# EasyEDA Pro project delta机械臂.eprj

# Schematic Schematic1

## Sheets
1 P1: Board Name: Board1; Create Date: 2025-07-07; Page Name: P1; Project Name: delta机械臂; Schematic Name: Schematic1; Update Date: 2025-09-25; Company: 嘉立创EDA; Page Size: A4; Version: V1.0
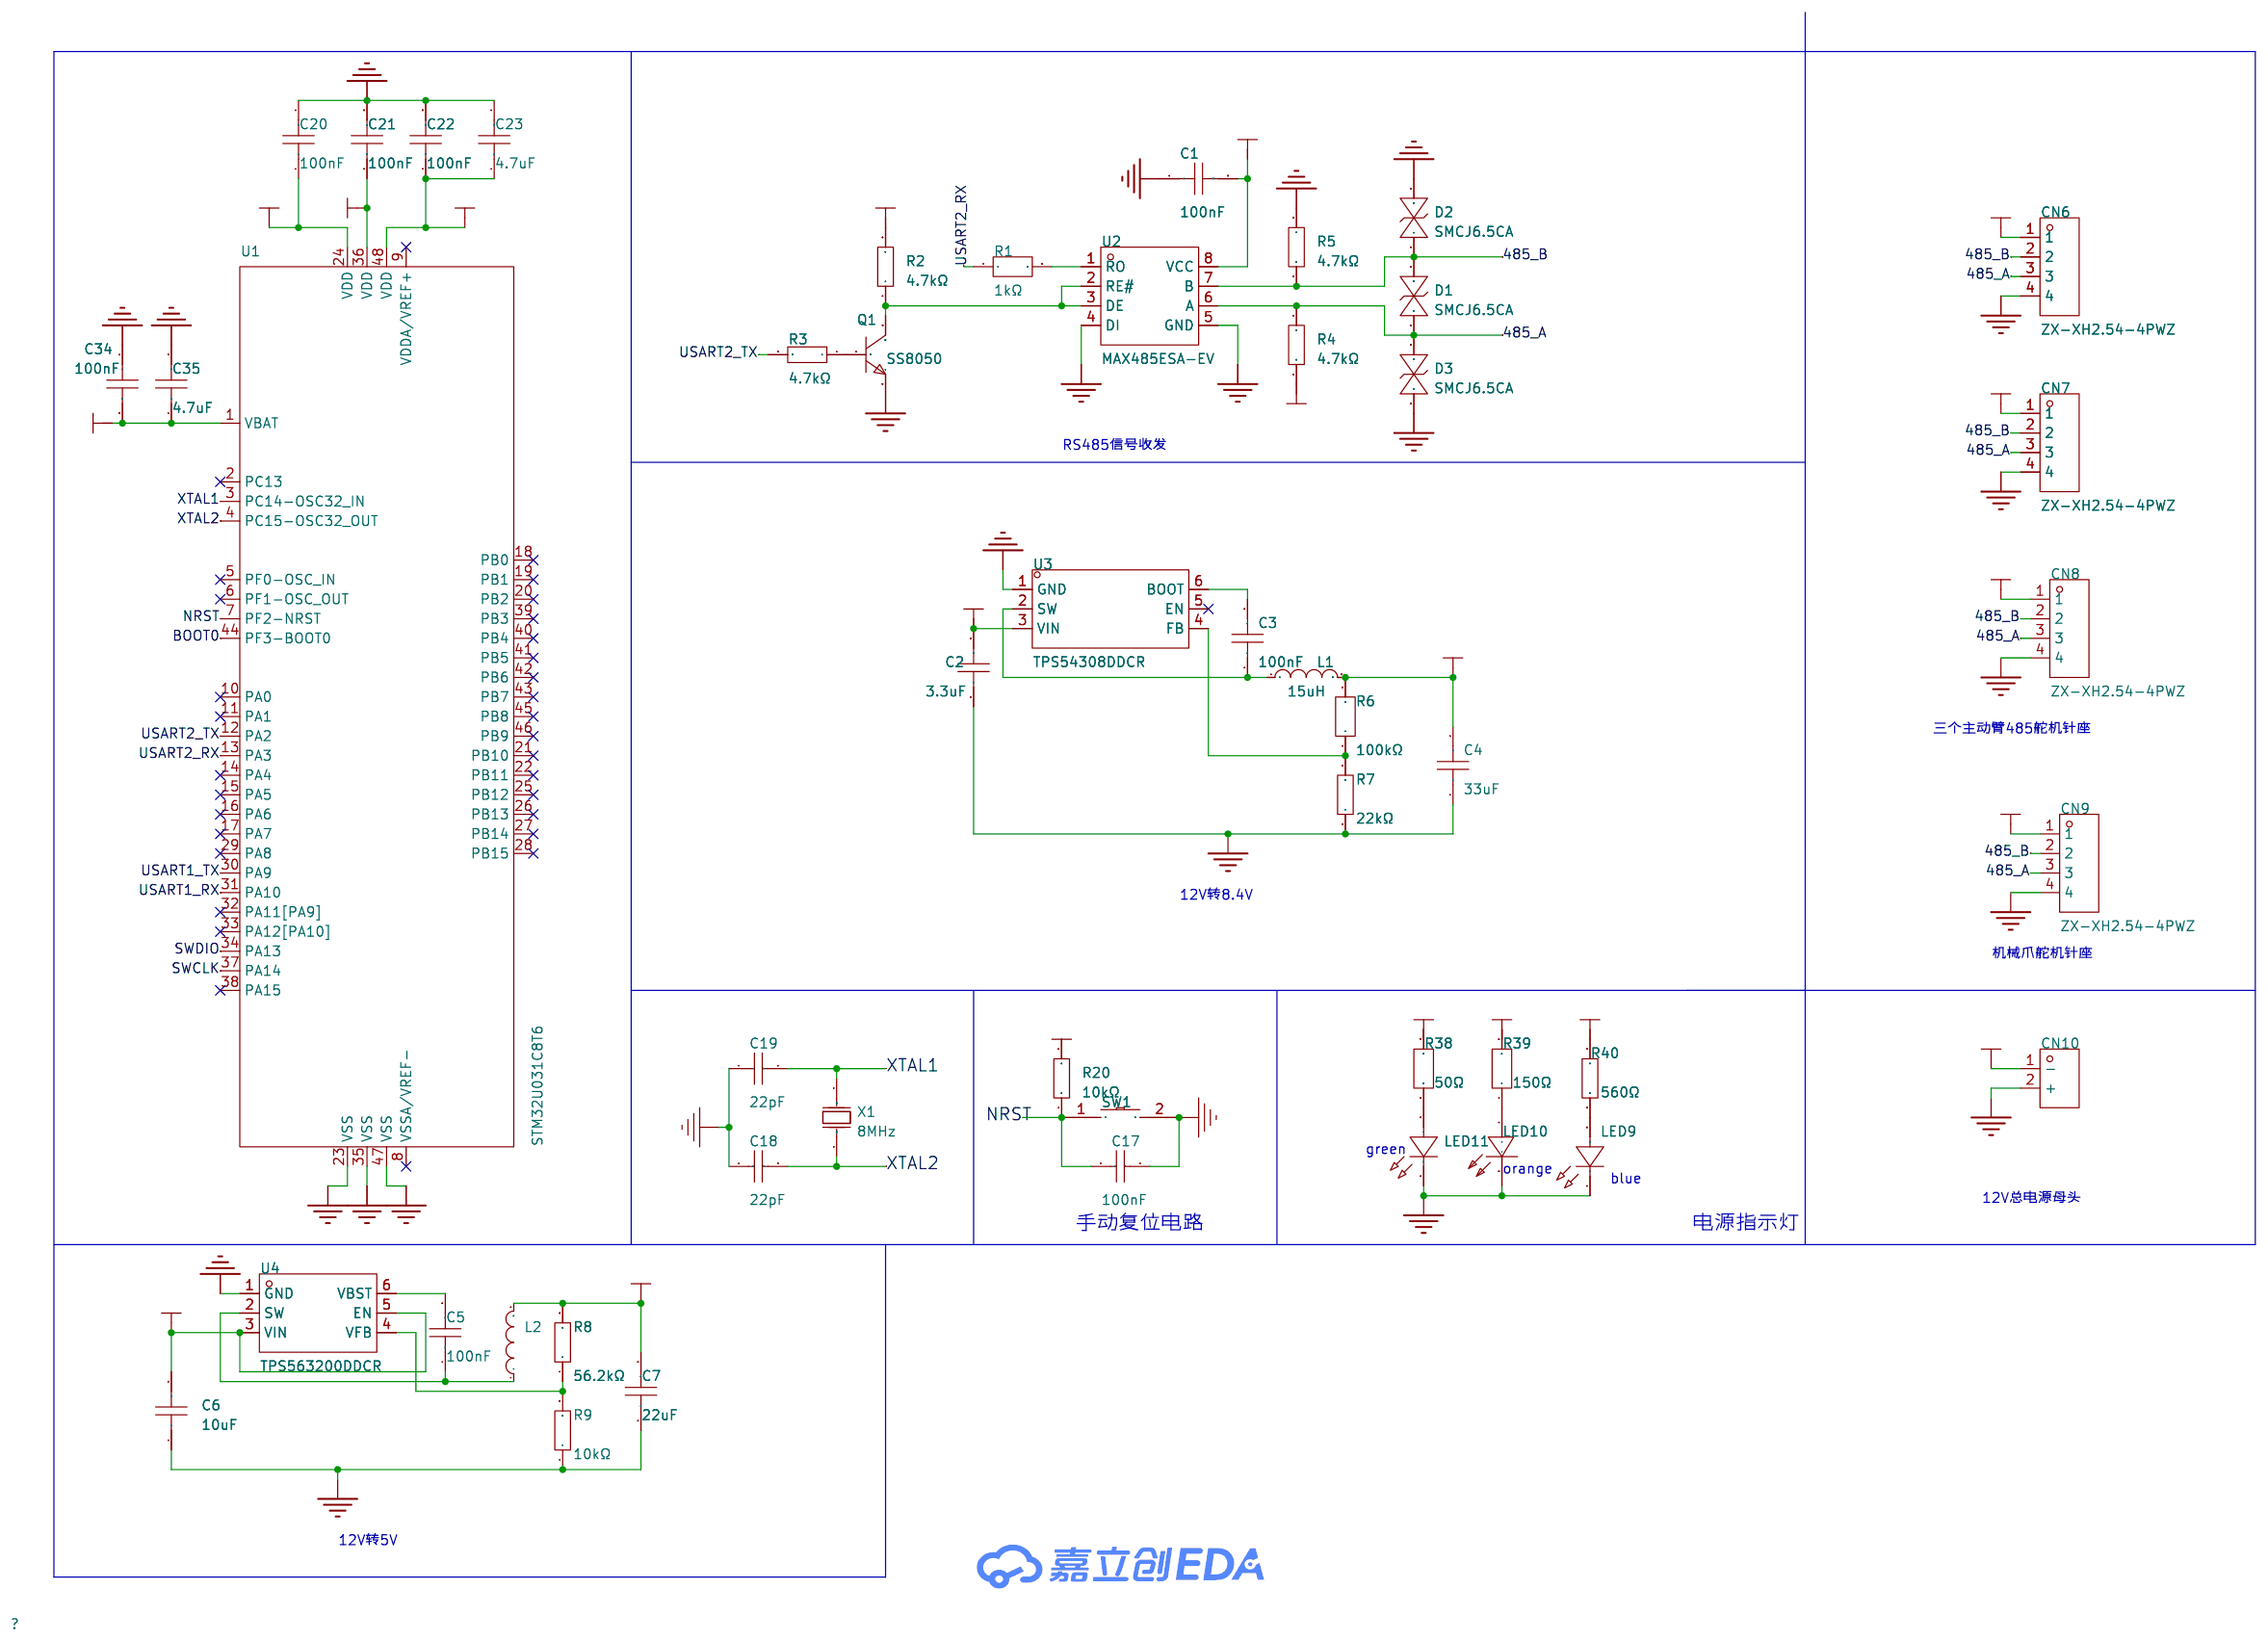
[diagram p0: P1]
2 P2: Create Date: 2025-07-26; Page Name: P2; Update Date: 2025-08-18
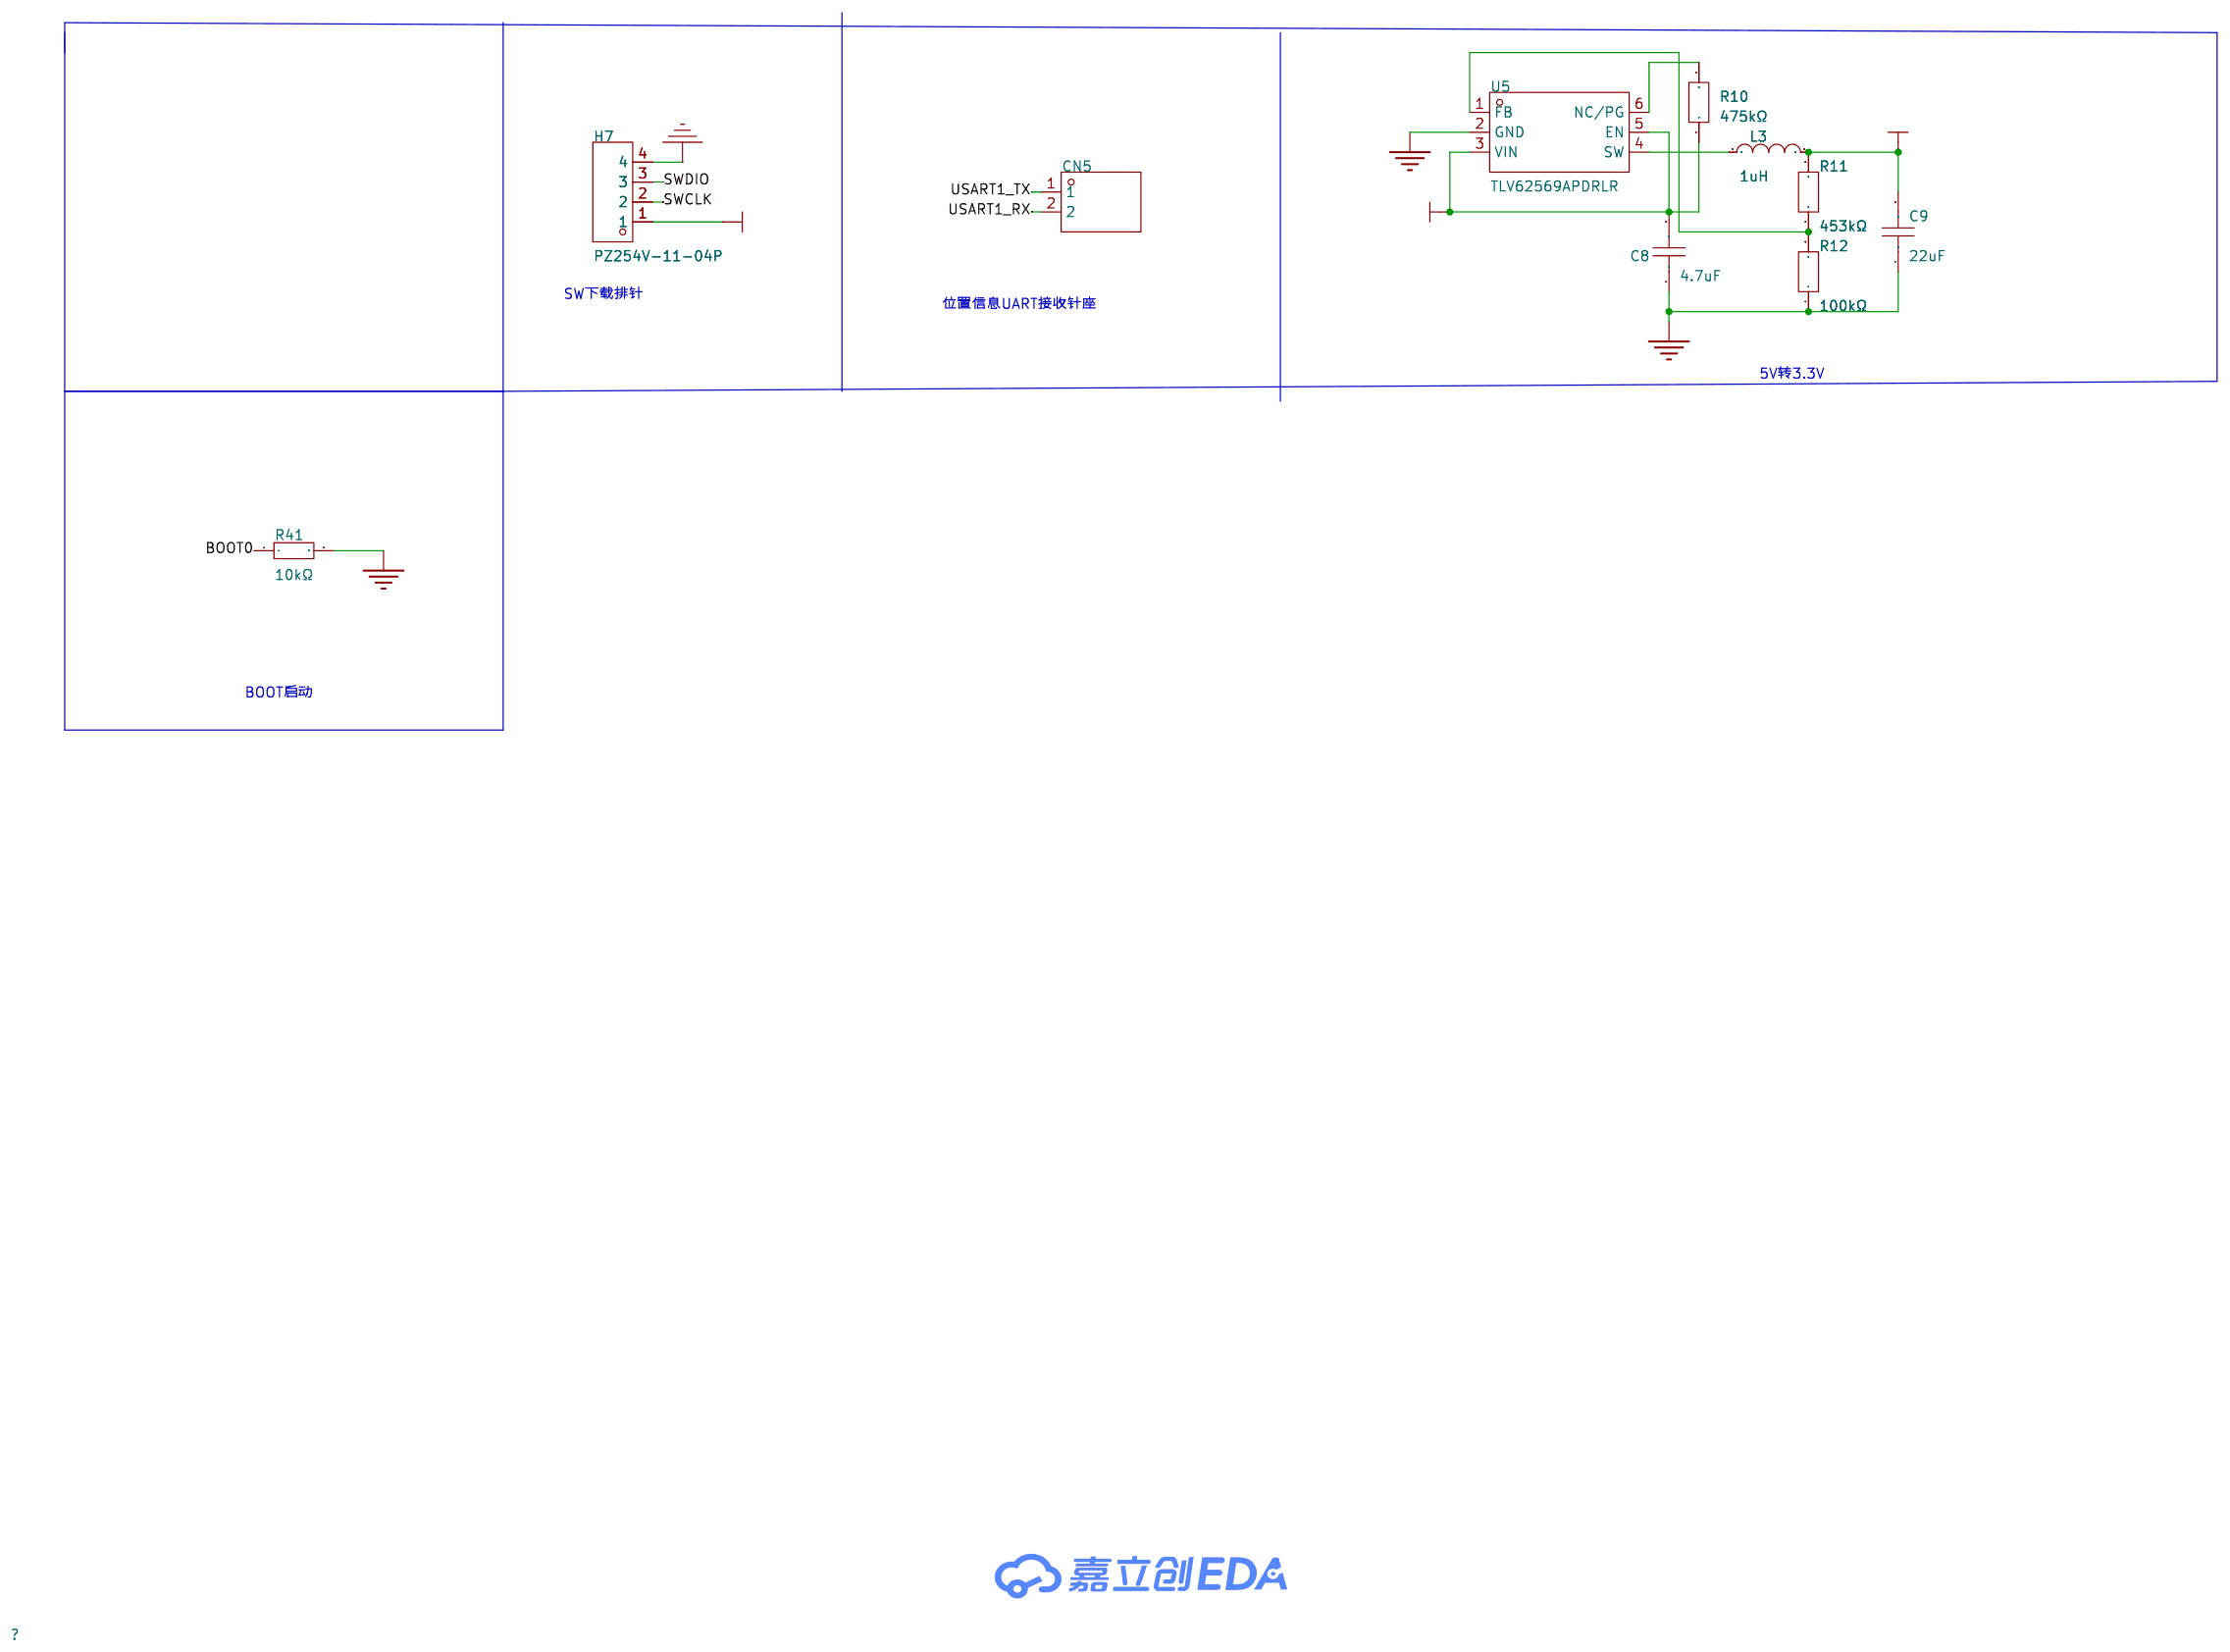
[diagram p1: P2]

## Parts
sheet P1
C1  100nF  [C0603]
C2  3.3uF  [C0603]
C3  100nF  [C0805]
C4  33uF  [C0805]
C5  100nF  [C0805]
C6  10uF  [C0805]
C7  22uF  [C0805]
C17  100nF  [C0805]
C18  22pF  [C0805]
C19  22pF  [C0805]
C20  100nF  [C0805]
C21  100nF  [C0805]
C22  100nF  [C0805]
C23  4.7uF  [C0805]
C34  100nF  [C0805]
C35  4.7uF  [C0805]
CN6  ZX-XH2.54-4PWZ  [CONN-TH_4P-P2.50_ZX-XH2.54-4PWZ]
CN7  ZX-XH2.54-4PWZ  [CONN-TH_4P-P2.50_ZX-XH2.54-4PWZ]
CN8  ZX-XH2.54-4PWZ  [CONN-TH_4P-P2.50_ZX-XH2.54-4PWZ]
CN9  ZX-XH2.54-4PWZ  [CONN-TH_4P-P2.50_ZX-XH2.54-4PWZ]
CN10  XT30UPB-M  [CONN-TH_XT30UPB-M]
D1  SMCJ6.5CA  [SMC_L6.8-W5.9-LS7.9-BI]
D2  SMCJ6.5CA  [SMC_L6.8-W5.9-LS7.9-BI]
D3  SMCJ6.5CA  [SMC_L6.8-W5.9-LS7.9-BI]
L1  15uH  [IND-SMD_L10.2-W10.0]
L2  VLP8040T-3R3N  [IND-SMD_L8.7-W8.6]
LED9  XL-1608UBC-04  [LED0603-RD_BLUE]
LED10  SZYY0603O  [LED0603-R-RD_ORANGE]
LED11  TZ-P2-0603YGTCS1-0.6T  [LED0603-RD]
Q1  SS8050  [SOT-23-3_L2.9-W1.3-P1.90-LS2.4-BR]
R1  1kΩ  [R0603]
R2  4.7kΩ  [R0603]
R3  4.7kΩ  [R0603]
R4  4.7kΩ  [R0603]
R5  4.7kΩ  [R0603]
R6  100kΩ  [R0402]
R7  22kΩ  [R0603]
R8  56.2kΩ  [R0201]
R9  10kΩ  [R0201]
R20  10kΩ  [R0805]
R38  50Ω  [R0805]
R39  150Ω  [R0805]
R40  560Ω  [R0805]
SW1  TS-1101-C-W  [SW-SMD_L6.0-W3.3-LS8.0]
U1  STM32U031C8T6  [LQFP-48_L7.0-W7.0-P0.50-LS9.0-BL_1]
U2  MAX485ESA-EV  [SOIC-8_L4.9-W3.9-P1.27-LS6.0-BL]
U3  TPS54308DDCR  [SOT-23-6_L2.9-W1.6-P0.95-LS2.8-BR]
U4  TPS563200DDCR  [SOT-23-6_L2.9-W1.6-P0.95-LS2.8-BR]
X1  8MHz  [CRYSTAL-SMD_L11.5-W4.8-LS12.7]
sheet P2
C8  4.7uF  [C0603]
C9  22uF  [C0603]
CN5  B2B-XH-A(LF)(SN)  [CONN-TH_B2B-XH-A-LF-SN]
H7  PZ254V-11-04P  [HDR-TH_4P-P2.54-V-M]
L3  1uH  [IND-SMD_L8.2-W7.9]
R10  475kΩ  [R0402]
R11  453kΩ  [R0402]
R12  100kΩ  [R0402]
R41  10kΩ  [R0805]
U5  TLV62569APDRLR  [SOT-563_L1.6-W1.2-P0.50-LS1.6-BR]

## Library data of the parts
C1 = CGA0603X7R104K500JT: LCSC Part Name: 100nF ±10% 50V; Supplier Part: C6119867; Manufacturer: HRE(芯声); Supplier Footprint: 0603; JLCPCB Part Class: 扩展库; Datasheet: https://atta.szlcsc.com/upload/public/pdf/source/20250103/C44077DA9E7B3EFAE02F22B6D3D1CBC9.pdf; Supplier: LCSC; Tolerance: ±10%; Voltage Rating: 50V; Temperature Coefficient: X7R
C2 = C1608X5R1V335K080AC: LCSC Part Name: 3.3uF ±10% 35V; Supplier Part: C6476469; Manufacturer: TDK; Supplier Footprint: 0603; Datasheet: https://atta.szlcsc.com/upload/public/pdf/source/20230606/A83975C7E70EF5AFCD4A17254ABD78F2.pdf; Supplier: LCSC; Tolerance: ±10%; Voltage Rating: 35V; Temperature Coefficient: X5R
C3 = C0805C104M5RACTU: LCSC Part Name: 100nF ±20% 50V; Supplier Part: C2167099; Manufacturer: KEMET(基美); Supplier Footprint: 0805; JLCPCB Part Class: 扩展库; Datasheet: https://atta.szlcsc.com/upload/public/pdf/source/20210401/FA43491E9CEFD02B2522131A2AAB865C.pdf; Supplier: LCSC; Tolerance: ±20%; Voltage Rated: 50V; Temperature Coefficient: X7R
C4 = C2012X5R1A336M125AC: LCSC Part Name: 33uF ±20% 10V; Supplier Part: C2168036; Manufacturer: TDK; Supplier Footprint: 0805; Datasheet: https://item.szlcsc.com/datasheet/C2012X5R1A336M125AC/2260088.html; Supplier: LCSC; Tolerance: ±20%; Voltage Rating: 10V; Temperature Coefficient: X5R
C5 = 08053C104KAT2A: LCSC Part Name: 100nF ±10% 25V; Supplier Part: C167411; Manufacturer: Kyocera AVX; Supplier Footprint: 0805; JLCPCB Part Class: 扩展库; Datasheet: https://atta.szlcsc.com/upload/public/pdf/source/20180224/C180862_15194369279611363953.pdf; Supplier: LCSC; Tolerance: ±10%; Voltage Rated: 25V; Temperature Coefficient: X7R
C6 = CL21A106KAYNNNE_C15850: LCSC Part Name: 10uF ±10% 25V; Supplier Part: C15850; Manufacturer: SAMSUNG(三星); Manufacturer Part: CL21A106KAYNNNE; Supplier Footprint: 0805; JLCPCB Part Class: 基础库; Datasheet: https://atta.szlcsc.com/upload/public/pdf/source/20160218/1457707763339.pdf; Supplier: LCSC; Tolerance: ±10%; Voltage Rated: 25V; Temperature Coefficient: X5R
C7 = GRM21BR61A226ME44L: LCSC Part Name: 22uF ±20% 10V; Supplier Part: C441864; Manufacturer: muRata(村田); Supplier Footprint: 0805; JLCPCB Part Class: 扩展库; Datasheet: https://atta.szlcsc.com/upload/public/pdf/source/20200305/C490387_23319AE8C154DEB24C505E6C82A8106A.pdf; Supplier: LCSC; Tolerance: ±20%; Voltage Rated: 10V; Temperature Coefficient: X5R
C17 = CL21B104KCFNNNE: LCSC Part Name: 100nF ±10% 100V; Supplier Part: C28233; Manufacturer: SAMSUNG(三星); Supplier Footprint: 0805; JLCPCB Part Class: 基础库; Datasheet: https://atta.szlcsc.com/upload/public/pdf/source/20160218/1457707763339.pdf; Supplier: LCSC; Tolerance: ±10%; Voltage Rated: 100V; Temperature Coefficient: X7R
C18 C19 = CL21C220JBANNNC: LCSC Part Name: 22pF ±5% 50V; Supplier Part: C1804; Manufacturer: SAMSUNG(三星); Supplier Footprint: 0805; JLCPCB Part Class: 基础库; Datasheet: https://atta.szlcsc.com/upload/public/pdf/source/20160218/1457707763339.pdf; Supplier: LCSC; Tolerance: ±5%; Voltage Rated: 50V; Temperature Coefficient: C0G
C20-C22 C34 = CC0805KRX7R9BB104: LCSC Part Name: 100nF ±10% 50V; Supplier Part: C49678; Manufacturer: YAGEO(国巨); Supplier Footprint: 0805; JLCPCB Part Class: 基础库; Datasheet: https://atta.szlcsc.com/upload/public/pdf/source/20180224/C181747_15194369449651363981.pdf; Supplier: LCSC; Tolerance: ±10%; Voltage Rated: 50V; Temperature Coefficient: X7R
C23 C35 = CGA0805X7R475K350MT: LCSC Part Name: 4.7uF ±10% 35V; Supplier Part: C6119943; Manufacturer: HRE(芯声); Supplier Footprint: 0805; JLCPCB Part Class: 扩展库; Supplier: LCSC; Tolerance: ±10%; Voltage Rated: 35V; Temperature Coefficient: X7R
CN6-CN9 = ZX-XH2.54-4PWZ: LCSC Part Name: 1x4P 间距:2.5mm 弯插 系列:XH; Supplier Part: C7429643; Manufacturer: Megastar(兆星); Supplier Footprint: 弯插,P=2.5mm; JLCPCB Part Class: 扩展库; Datasheet: https://item.szlcsc.com/datasheet/ZX-XH2.54-4PWZ/8427560.html; Supplier: LCSC; Pins Structure: 1x4P; Pitch: 2.5mm; Mounting Type: 弯插; Reference Series: XH; Number of Pins: 4P; Number of Rows: 1; Number of PINs Per Row: 4; Current Rating: 3A; Contact Material: 黄铜; Contact Plating: 锡; Operating Temperature: -25℃~+85℃; Voltage Rating: 250V; Plastic Material: PA66; Flame Retardant Rating: UL94V-0; Color: 白色; Z-Height of the Board: 5.9mm; X-Length of Bottom Edge on Board (Spacing Line): 12.5mm; Y-Width of Bottom Edge on Board: 7.32mm
CN10 = XT30UPB-M: LCSC Part Name: AMASS(艾迈斯)板载立式 航模锂电池控制器连接器插头 公头XT30UPB-M; Supplier Part: C428721; Manufacturer: AMASS(艾迈斯); JLCPCB Part Class: 扩展库; Datasheet: https://item.szlcsc.com/datasheet/XT30UPB-M/423831.html; Supplier: LCSC; Type: 航模插头; Colour: 黄色; RatedVoltage: DC 500V; InterfaceType: 公头; MetalMaterial: 镀金; InsulationMaterial: PA; RatedCurrent: 15A; contact resistance: 0.65mΩ
D1-D3 = SMCJ6.5CA_C20623833: Supplier Part: C20623833; Manufacturer: Brightking(君耀电子); Supplier Footprint: SMC; JLCPCB Part Class: 扩展库; Datasheet: https://atta.szlcsc.com/upload/public/pdf/source/20240223/9A65FA5599D1B01CD9C6D8029383C398.pdf; Supplier: LCSC
L1 = MSS1038-153MLC: Supplier Part: C18212714; Manufacturer: Coilcraft(线艺); Supplier Footprint: SMD,10.2x10mm; JLCPCB Part Class: 扩展库; Datasheet: https://www.coilcraft.com/getmedia/3e03a7b4-3b1d-4f31-b1f3-e7c621695ac0/mss1038.pdf; Supplier: LCSC; Tolerance: ±20%
L2 = VLP8040T-3R3N: LCSC Part Name: ±30%; Supplier Part: C20464369; Manufacturer: TDK; Datasheet: https://atta.szlcsc.com/upload/public/pdf/source/20181022/C307849_B481C7A0812203402FA1143FFCB19149.pdf; Supplier: LCSC; Tolerance: ±30%
LED9 = XL-1608UBC-04: LCSC Part Name: 0603蓝色贴片式发光二极管; Supplier Part: C965807; Manufacturer: XINGLIGHT(成兴光); Supplier Footprint: 0603; JLCPCB Part Class: 扩展库; Datasheet: https://item.szlcsc.com/datasheet/XL-1608UBC-04/1051416.html; Supplier: LCSC; Illumination Color: 蓝色; Voltage - Forward(Vf): 3.3V; Power(Watts): 70mW; Forward Current: 20mA; Wavelength - Dominant: 455nm~475nm; Peak Wavelength: 470nm; Lens Color: 无色透明透镜; Luminous Intensity: 300mcd; Viewing Angle: 120°; Mounting Style: 正贴
LED10 = SZYY0603O: LCSC Part Name: 橙灯; Supplier Part: C434425; Manufacturer: yongyu(永裕光电); Supplier Footprint: 0603; JLCPCB Part Class: 扩展库; Datasheet: https://atta.szlcsc.com/upload/public/pdf/source/20191204/C434425_679BD20504459C5C77B058A13BF09BD8.pdf; Supplier: LCSC; Emitted Color: 橙色; Power Dissipation: 40mW; Forward Current: 10mA; Dominant Wavelength: 598nm~608nm; Peak Wavelength: 612nm; Lens Color: 无色透明透镜; Viewing Angle: 120°; Operating Temperature: -40℃~+85℃
LED11 = TZ-P2-0603YGTCS1-0.6T: LCSC Part Name: 普绿/黄绿; Supplier Part: C916074; Manufacturer: TUOZHAN(拓展光电); Supplier Footprint: 0603; JLCPCB Part Class: 扩展库; Datasheet: https://item.szlcsc.com/datasheet/TZ-P2-0603YGTCS1-0.6T/990102.html; Supplier: LCSC; Illumination Color: 绿色; Voltage - Forward(Vf): 1.9V~2.4V; Power(Watts): 60mW; Forward Current: 20mA; Wavelength - Dominant: 570nm~575nm; Peak Wavelength: 574nm; Lens Color: 无色透明透镜; Luminous Intensity: 50mcd; Viewing Angle: 120°; Operating Temperature: -40℃~+80℃
Q1 = SS8050: LCSC Part Name: NPN 25V 1.5A 120-400 SOT-23; Supplier Part: C2931717; Manufacturer: Doeshare(德芯); Supplier Footprint: SOT-23; JLCPCB Part Class: 扩展库; Datasheet: https://atta.szlcsc.com/upload/public/pdf/source/20220106/99F9A3DFCBDD91265C711555CE6390BF.pdf; Supplier: LCSC
R1 = FCR0603F1K: LCSC Part Name: 1K ±1%; Supplier Part: C5913168; Manufacturer: VO(翔胜); Supplier Footprint: 0603; JLCPCB Part Class: 扩展库; Datasheet: https://atta.szlcsc.com/upload/public/pdf/source/20230428/98B65D379E9BA4CF2A9223D1647B01B6.pdf; Supplier: LCSC; Type: 厚膜电阻; Tolerance: ±1%; Power(Watts): 100mW; Overload Voltage (Max): 75V; Operating Temperature Range: -55℃~+155℃
R2-R5 = 0603WAF4701T5E: LCSC Part Name: 4.7kΩ ±1% 100mW 厚膜电阻; Supplier Part: C23162; Manufacturer: UNI-ROYAL(厚声); Supplier Footprint: 0603; JLCPCB Part Class: 基础库; Datasheet: https://atta.szlcsc.com/upload/public/pdf/source/20200306/C422600_1E6D84923E4A46A82E41ADD87F860B5C.pdf; Supplier: LCSC; Type: 厚膜电阻; Tolerance: ±1%; Power(Watts): 100mW; Overload Voltage (Max): 75V; Temperature Coefficient: ±100ppm/℃; Operating Temperature Range: -55℃~+155℃
R6 R12 = CRCW0402100KFKED: LCSC Part Name: 厚膜电阻 100kΩ ±1% 63mW; Supplier Part: C481918; Manufacturer: VISHAY(威世); Supplier Footprint: 0402; Datasheet: https://item.szlcsc.com/datasheet/CRCW0402100KFKED/489944.html; Supplier: LCSC; Type: 厚膜电阻; Tolerance: ±1%; Power(Watts): 63mW; Voltage-Supply(Max): 75V; Temperature Coefficient: ±100ppm/℃; Operating Temperature: -55℃~+155℃
R7 = RC0603FR-0722KL: LCSC Part Name: 厚膜电阻 22kΩ ±1% 100mW; Supplier Part: C114065; Manufacturer: YAGEO(国巨); Supplier Footprint: 0603; JLCPCB Part Class: 扩展库; Datasheet: https://item.szlcsc.com/datasheet/RC0603FR-0722KL/115304.html; Supplier: LCSC; Type: 厚膜电阻; Tolerance: ±1%; Power(Watts): 100mW; Voltage-Supply(Max): 75V; Temperature Coefficient: ±100ppm/℃; Operating Temperature: -55℃~+155℃
R8 = RC0201FR-0756K2L: LCSC Part Name: 厚膜电阻 56.2kΩ ±1% 50mW; Supplier Part: C327383; Manufacturer: YAGEO(国巨); Supplier Footprint: 0201; Datasheet: https://atta.szlcsc.com/upload/public/pdf/source/20250610/89E4D743C004A82A45145C7A2CC3A578.pdf; Supplier: LCSC; Type: 厚膜电阻; Tolerance: ±1%; Power(Watts): 50mW; Voltage-Supply(Max): 25V; Temperature Coefficient: ±200ppm/℃; Operating Temperature: -55℃~+125℃
R9 = RC0201FR-0710KL: LCSC Part Name: 厚膜电阻 10kΩ ±1% 50mW; Supplier Part: C106225; Manufacturer: YAGEO(国巨); Supplier Footprint: 0201; JLCPCB Part Class: 扩展库; Datasheet: https://item.szlcsc.com/datasheet/RC0201FR-0710KL/107440.html; Supplier: LCSC; Type: 厚膜电阻; Tolerance: ±1%; Power(Watts): 50mW; Voltage-Supply(Max): 25V; Temperature Coefficient: ±200ppm/℃; Operating Temperature: -55℃~+125℃
R20 R41 = 0805W8F1002T5E_C17414: LCSC Part Name: 10kΩ ±1% 125mW 厚膜电阻; Supplier Part: C17414; Manufacturer: UNI-ROYAL(厚声); Manufacturer Part: 0805W8F1002T5E; Supplier Footprint: 0805; JLCPCB Part Class: 基础库; Datasheet: https://atta.szlcsc.com/upload/public/pdf/source/20200306/C422600_1E6D84923E4A46A82E41ADD87F860B5C.pdf; Supplier: LCSC; Type: 厚膜电阻; Tolerance: ±1%; Power(Watts): 125mW; Overload Voltage (Max): 150V; Temperature Coefficient: ±100ppm/℃; Operating Temperature Range: -55℃~+155℃
R38 = ARG05FTC0500: LCSC Part Name: 薄膜电阻 50Ω ±1% 125mW; Supplier Part: C2828866; Manufacturer: Viking(光颉); Supplier Footprint: 0805; JLCPCB Part Class: 扩展库; Datasheet: https://atta.szlcsc.com/upload/public/pdf/source/20211009/C2828883_CAE7D170B8B230FC4A048BDC7B3A81FC.pdf; Supplier: LCSC; Type: 薄膜电阻; Tolerance: ±1%; Power(Watts): 125mW; Overload Voltage (Max): 150V; Temperature Coefficient: ±25ppm/℃; Operating Temperature Range: -55℃~+155℃
R39 = FRC0805J151 TS: LCSC Part Name: 150Ω ±5% 125mW 厚膜电阻; Supplier Part: C2907300; Manufacturer: FOJAN(富捷); Supplier Footprint: 0805; JLCPCB Part Class: 扩展库; Datasheet: https://atta.szlcsc.com/upload/public/pdf/source/20211221/925EC7D7225764EE0046F22065062C87.pdf; Supplier: LCSC; Type: 厚膜电阻; Tolerance: ±5%; Power(Watts): 125mW; Overload Voltage (Max): 150V; Temperature Coefficient: ±100ppm/℃; Operating Temperature Range: -55℃~+155℃
R40 = 0805W8F5600T5E: LCSC Part Name: 560Ω ±1% 125mW 厚膜电阻; Supplier Part: C28636; Manufacturer: UNI-ROYAL(厚声); Supplier Footprint: 0805; JLCPCB Part Class: 基础库; Datasheet: https://atta.szlcsc.com/upload/public/pdf/source/20200306/C422600_1E6D84923E4A46A82E41ADD87F860B5C.pdf; Supplier: LCSC; Type: 厚膜电阻; Tolerance: ±1%; Power(Watts): 125mW; Overload Voltage (Max): 150V; Temperature Coefficient: ±100ppm/℃; Operating Temperature Range: -55℃~+155℃
SW1 = TS-1101-C-W: LCSC Part Name: 6*3.6*2.5mm 立贴 轻触开关; Supplier Part: C318938; Manufacturer: XKB Connectivity(中国星坤); Supplier Footprint: SMD; JLCPCB Part Class: 扩展库; Datasheet: https://atta.szlcsc.com/upload/public/pdf/source/20200227/C318938_C2E53B1EEDE37D980A33616AC086DE53.pdf; Supplier: LCSC; Circuit: 单刀单掷; Actuator Style: 矩形按钮; Operating Force: 260gf; Mounting Style: 立贴; Switch Length: 6mm; Switch Width: 3.6mm; Switch Height: 2.5mm; Strike Gundam: 不带; Contact Current: 50mA; Voltage Rating (DC): 12V; Actuator/Cap Color: 白色带淡绿; With Lamp: 无; Mechanical Life: 5万次; Operating Temperature: -30℃~+85℃
U1 = STM32U031C8T6: Supplier Part: C9900155493; Supplier Footprint: LQFP48; Supplier: LCSC
U2 = MAX485ESA-EV: Supplier Part: C28642204; Manufacturer: EVVO(翊欧); Supplier Footprint: SOP-8; JLCPCB Part Class: 扩展库; Datasheet: https://atta.szlcsc.com/upload/public/pdf/source/20240712/60855B1C00EFEBB875C1185125556C25.pdf; Supplier: LCSC
U3 = TPS54308DDCR: LCSC Part Name: 4.5V至28V输入,3A输出同步降压转换器; Supplier Part: C168839; Manufacturer: TI(德州仪器); Supplier Footprint: SOT-23-6; Datasheet: https://www.ti.com/cn/lit/gpn/tps54308; Supplier: LCSC; Function: 降压型; Output Type: 固定; Input Voltage: 4.5V~28V; Output Voltage: 3.3V; Output Current: 3A; Switching Frequency: 350kHz; Operating Temperature: -40℃~+125℃; Synchronous Rectification: 是; Number of Outputs: 1; Topology: 降压式; Quiescent Current (Iq): 300uA; Switch tube (built-in/external): 内置
U4 = TPS563200DDCR: LCSC Part Name: 4.5V至17V输入,2A/3A同步降压稳压器; Supplier Part: C97253; Manufacturer: TI(德州仪器); Supplier Footprint: TSOT-23-6; JLCPCB Part Class: 扩展库; Datasheet: https://www.ti.com/cn/lit/gpn/tps563200; Supplier: LCSC; Function: 降压型; Output Type: 可调; Input Voltage: 4.5V~17V; Output Voltage: 760mV~7V; Output Current: 3A; Switching Frequency: 650kHz; Operating Temperature: -40℃~+125℃; Synchronous Rectification: 是; Number of Outputs: 1; Topology: 降压式; Quiescent Current (Iq): 290uA; Switch tube (built-in/external): 内置
X1 = X49SM8MSD2SC: LCSC Part Name: HC-49SMD 8MHZ 2P 49SMD 20PF ±20PPM -20~70℃（±30PPM）; Supplier Part: C12674; Manufacturer: YXC(扬兴晶振); Supplier Footprint: HC-49S-SMD; JLCPCB Part Class: 基础库; Datasheet: https://atta.szlcsc.com/upload/public/pdf/source/20240329/3EBF42EBCAB50CA65B6FA9D7CFA1955A.pdf; Supplier: LCSC; Type: 贴片晶振; Normal temperature Frequency Tolerance: ±20ppm; Load Capacitance: 20pF; Frequency Stability: ±30ppm; Operating Temperature: -20℃~+70℃
C8 = CL10A475KO8NNNC: LCSC Part Name: 4.7uF ±10% 16V; Supplier Part: C19666; Manufacturer: SAMSUNG(三星); Supplier Footprint: 0603; Datasheet: https://item.szlcsc.com/datasheet/CL10A475KO8NNNC/20375.html; Supplier: LCSC; Tolerance: ±10%; Voltage Rating: 16V; Temperature Coefficient: X5R
C9 = GRM188R60J226MEA0D: LCSC Part Name: 22uF ±20% 6.3V; Supplier Part: C77042; Manufacturer: muRata(村田); Supplier Footprint: 0603; JLCPCB Part Class: 扩展库; Datasheet: https://atta.szlcsc.com/upload/public/pdf/source/20200305/C490387_23319AE8C154DEB24C505E6C82A8106A.pdf; Supplier: LCSC; Tolerance: ±20%; Voltage Rated: 6.3V; Temperature Coefficient: X5R
CN5 = B2B-XH-A(LF)(SN): LCSC Part Name: 1x2P 间距:2.5mm 直插 系列:XH; Supplier Part: C158012; Manufacturer: JST; Supplier Footprint: 插件,P=2.5mm; JLCPCB Part Class: 扩展库; Datasheet: https://atta.szlcsc.com/upload/public/pdf/source/20180928/C265283_F9DFEEBDB2CF642B6BDFAB4B77BD2680.pdf; Supplier: LCSC; Pins Structure: 1x2P; Pitch: 2.5mm; Mounting Style: 直插; Reference Series: XH; Number of Pins: 2P; Number of Rows: 1; Number of PINs Per Row: 2; Current Rating (Max): 3A; Contact Material: 黄铜; Contact Plating: 锡; Operating Temperature Range: -25℃~+85℃; Rated Voltage (Max): 250V; Plastic Material: PA66; Flame Retardant Rating: UL94V-0; Supplementary Features: 打K脚; Colour: 白色; Z-Height of the Board: 7mm; X-Length of Bottom Edge on Board (Spacing Line): 7.4mm; Y-Width of Bottom Edge on Board: 5.75mm
H7 = PZ254V-11-04P: LCSC Part Name: 间距:2.54mm 1x4P 直插 方针; Supplier Part: C2691448; Manufacturer: XFCN(兴飞); Supplier Footprint: 插件,P=2.54mm; JLCPCB Part Class: 扩展库; Datasheet: https://atta.szlcsc.com/upload/public/pdf/source/20200309/C492403_F9F19131791D08044AD4F84F8E751A34.pdf; Supplier: LCSC; Pin Structure: 1x4P; Pitch: 2.54mm; Circluar Pins/Square Pins: 方针; Mounting Type: 直插; Number of Rows: 单排; Number of Pins: 4P; Current Rating (Max): 3A; Voltage Rating (Max): 250V; Length of Mating Pin: 6mm; Insulation Height: 2.5mm; Length of End Connection Pin: 3mm; Operating Temperature Range: -40℃~+105℃; Color: 黑色
L3 = SRN8040-1R0Y: LCSC Part Name: 1uH ±30% 11A; Supplier Part: C2041438; Manufacturer: BOURNS; Supplier Footprint: SMD,8.2x7.9mm; JLCPCB Part Class: 扩展库; Datasheet: https://item.szlcsc.com/datasheet/SRN8040-1R0Y/2133001.html; Supplier: LCSC; Tolerance: ±30%; Current Rating: 7.8A; Current - Saturation(Isat): 11A; DC Resistance(DCR): 10mΩ
R10 = CRCW0402475KFKED: LCSC Part Name: 厚膜电阻 475kΩ ±1% 62.5mW; Supplier Part: C2085628; Manufacturer: VISHAY(威世); Supplier Footprint: 0402; JLCPCB Part Class: 扩展库; Datasheet: https://atta.szlcsc.com/upload/public/pdf/source/20210503/4CAD3FA9B4C9A749933C1C52DBF827C2.pdf; Supplier: LCSC; Type: 厚膜电阻; Tolerance: ±1%; Power(Watts): 62.5mW; Overload Voltage (Max): 75V; Temperature Coefficient: ±100ppm/℃; Operating Temperature Range: -55℃~+155℃
R11 = CRCW0402453KFKED: LCSC Part Name: 厚膜电阻 453kΩ ±1% 62.5mW; Supplier Part: C843903; Manufacturer: VISHAY(威世); Supplier Footprint: 0402; JLCPCB Part Class: 扩展库; Datasheet: https://item.szlcsc.com/datasheet/CRCW0402453KFKED/903477.html; Supplier: LCSC; Type: 厚膜电阻; Tolerance: ±1%; Power(Watts): 62.5mW; Voltage-Supply(Max): 50V; Temperature Coefficient: ±100ppm/℃; Operating Temperature: -55℃~+155℃
U5 = TLV62569APDRLR: Supplier Part: C398366; Manufacturer: TI(德州仪器); Supplier Footprint: SOT-563; JLCPCB Part Class: 扩展库; Datasheet: https://www.ti.com/cn/lit/gpn/tlv62568a; Supplier: LCSC; Function: 降压型; Output Type: 可调; Voltage - Supply: 2.5V~5.5V; Output Voltage: 600mV~5.5V; Output Current: 2A; Frequency - Switching: 1.5MHz; Operating Temperature: -40℃~+125℃@(TJ); Synchronous Rectifier: 是; Number of Outputs: 1; Topology: 降压式; Switch tube (built-in/external): 内置

## Nets
3.3V: C1.2 C9.2 C20.1 C21.1 C22.1 C23.1 C34.2 C35.1 H7.1 L3.2 R2.2 R4.2 R11.2 R20.2 R38.2 U1.1(VBAT) U1.24(VDD) U1.36(VDD) U1.48(VDD) U2.8(VCC)
5V: C7.2 C8.2 L2.2 R8.2 R10.1 R39.2 U5.3(VIN) U5.5(EN)
8.4V: C4.2 CN6.1 CN7.1 CN8.1 CN9.1 L1.2 R6.2
12V: C2.2 C6.2 CN10.1(-) R40.2 U3.3(VIN) U4.3(VIN) U4.5(EN)
GND: C1.1 C2.1 C4.1 C6.1 C7.1 C8.1 C9.1 C17.2 C18.1 C19.1 C20.2 C21.2 C22.2 C23.2 C34.1 C35.2 CN6.4 CN7.4 CN8.4 CN9.4 CN10.2(+) D2.2 D3.1 H7.4 LED9.1(K) LED10.2(-) LED11.1(K) Q1.2(E) R5.1 R7.1 R9.1 R12.1 R41.2 SW1.2 U1.23(VSS) U1.35(VSS) U1.47(VSS) U2.4(DI) U2.5(GND) U3.1(GND) U4.1(GND) U5.2(GND)
485_A: CN6.3 CN7.3 CN8.3 CN9.3 D1.1 D3.2 R4.1 U2.6(A)
485_B: CN6.2 CN7.2 CN8.2 CN9.2 D1.2 D2.1 R5.2 U2.7(B)
BOOT0: R41.1 U1.44(PF3-BOOT0)
NRST: C17.1 R20.1 SW1.1 U1.7(PF2-NRST)
SWCLK: H7.2 U1.37(PA14)
SWDIO: H7.3 U1.34(PA13)
USART1_RX: CN5.2 U1.31(PA10)
USART1_TX: CN5.1 U1.30(PA9)
USART2_RX: R1.1 U1.13(PA3)
USART2_TX: R3.2 U1.12(PA2)
XTAL1: C19.2 U1.3(PC14-OSC32_IN) X1.1(OSC1)
XTAL2: C18.2 U1.4(PC15-OSC32_OUT) X1.2(OSC2)
$1N1217: R1.2 U2.1(RO)
$1N1226: Q1.3(C) R2.1 U2.2(RE#) U2.3(DE)
$1N1489: Q1.1(B) R3.1
$1N27759: R6.1 R7.2 U3.4(FB)
$1N27841: C3.1 L1.1 U3.2(SW)
$1N27868: C3.2 U3.6(BOOT)
$1N28538: C5.2 U4.6(VBST)
$1N28548: C5.1 L2.1 U4.2(SW)
$1N28571: R8.1 R9.2 U4.4(VFB)
$1N28810: LED9.2(A) R40.1
$1N28900: LED10.1(+) R39.1
$1N29030: LED11.2(A) R38.1
$2N3319: R10.2 U5.6(NC/PG)
$2N3396: L3.1 U5.4(SW)
$2N3405: R11.1 R12.2 U5.1(FB)

Not connected (* = marked no-connect by the designer): U1 2(PC13)* 5(PF0-OSC_IN)* 6(PF1-OSC_OUT)* 8(VSSA/VREF-)* 9(VDDA/VREF+)* 10(PA0)* 11(PA1)* 14(PA4)* 15(PA5)* 16(PA6)* 17(PA7)* 18(PB0)* 19(PB1)* 20(PB2)* 21(PB10)* 22(PB11)* 25(PB12)* 26(PB13)* 27(PB14)* 28(PB15)* 29(PA8)* 32(PA11[PA9])* 33(PA12[PA10])* 38(PA15)* 39(PB3)* 40(PB4)* 41(PB5)* 42(PB6)* 43(PB7)* 45(PB8)* 46(PB9)*; U3 5(EN)*

## Notes on the sheets
sheet 1
- RS485信号收发
- 三个主动臂485舵机针座
- 12V转8.4V
- 机械爪舵机针座
- green
- orange
- blue
- 手动复位电路
- 电源指示灯
- 12V总电源母头
- 12V转5V
sheet 2
- SW下载排针
- 位置信息UART接收针座
- 5V转3.3V
- BOOT启动

# Board PCB1
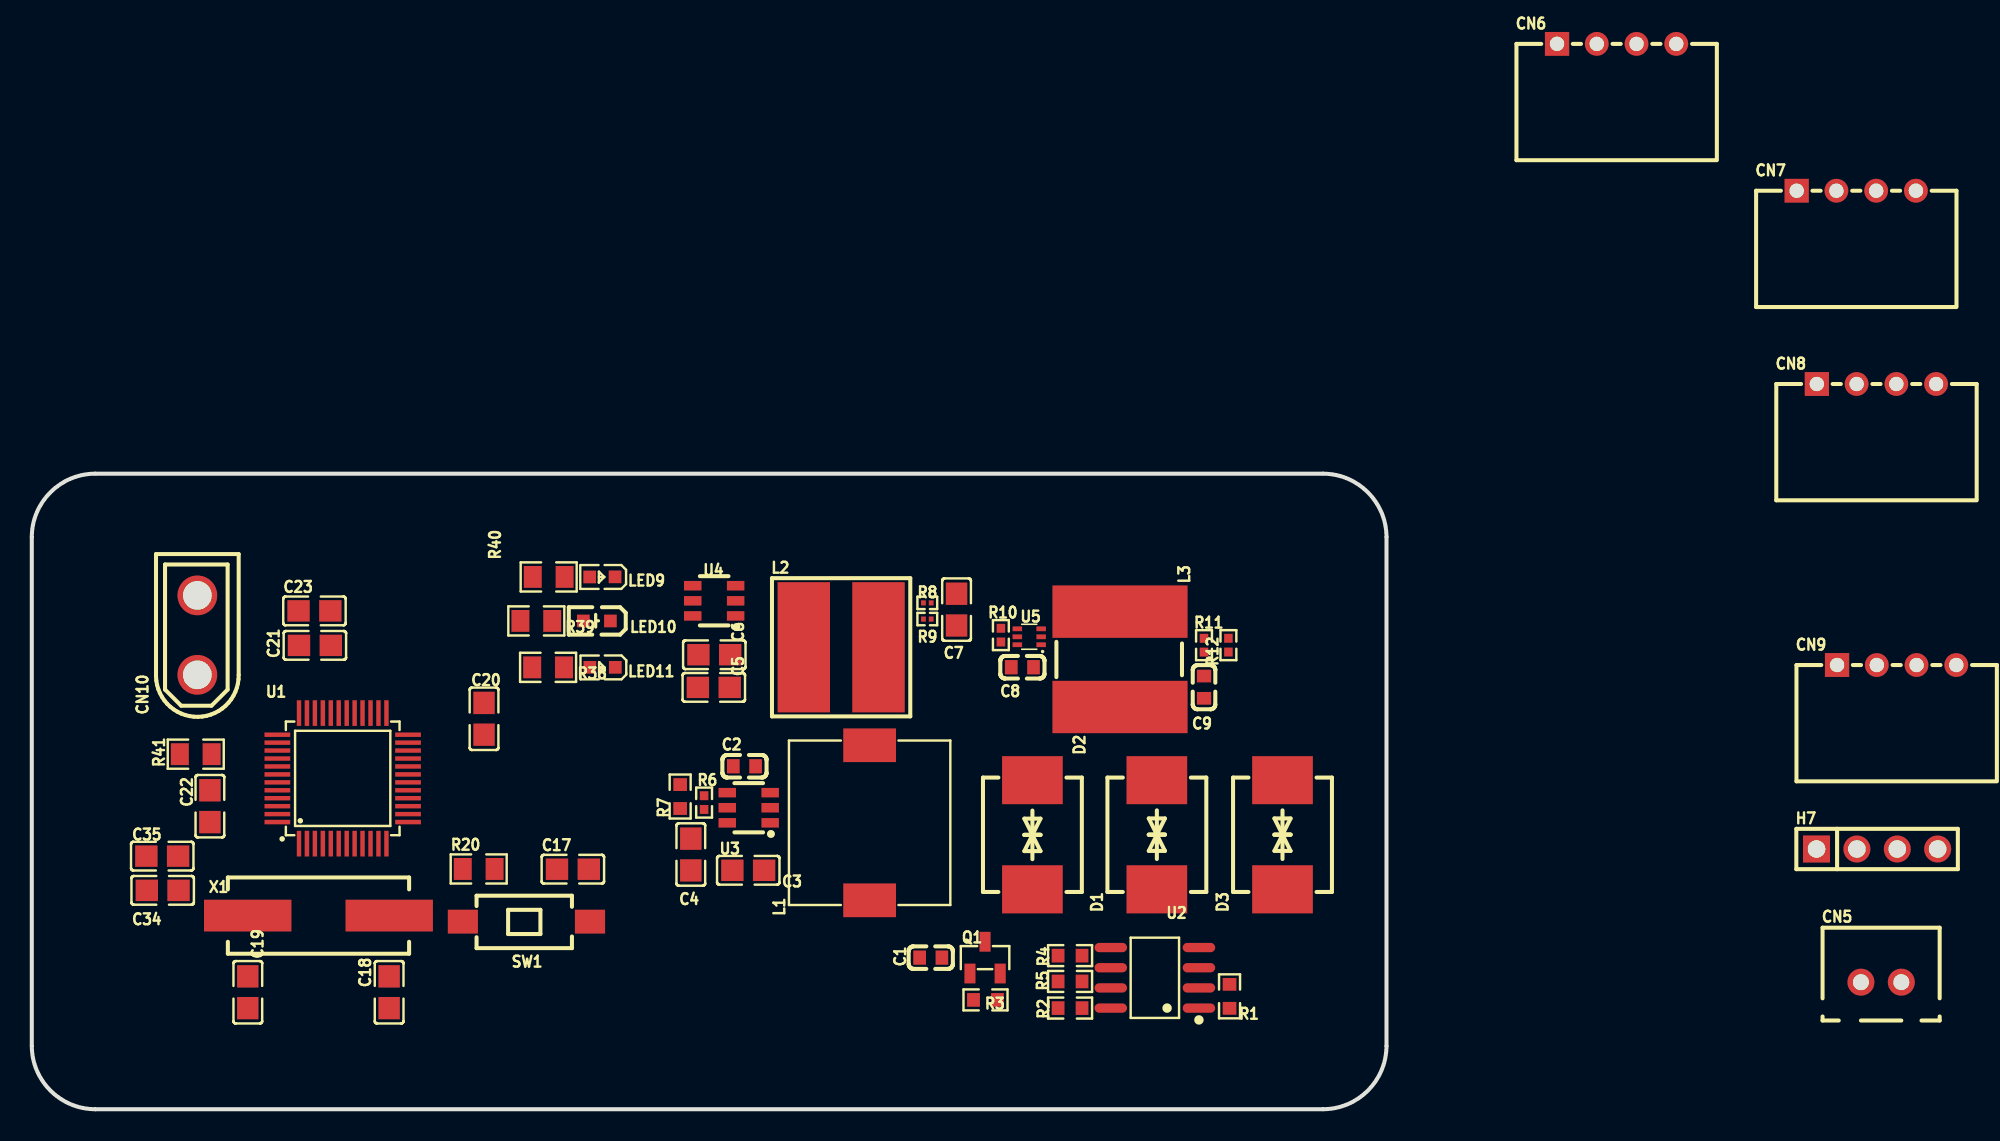
[diagram p2: board, top side]
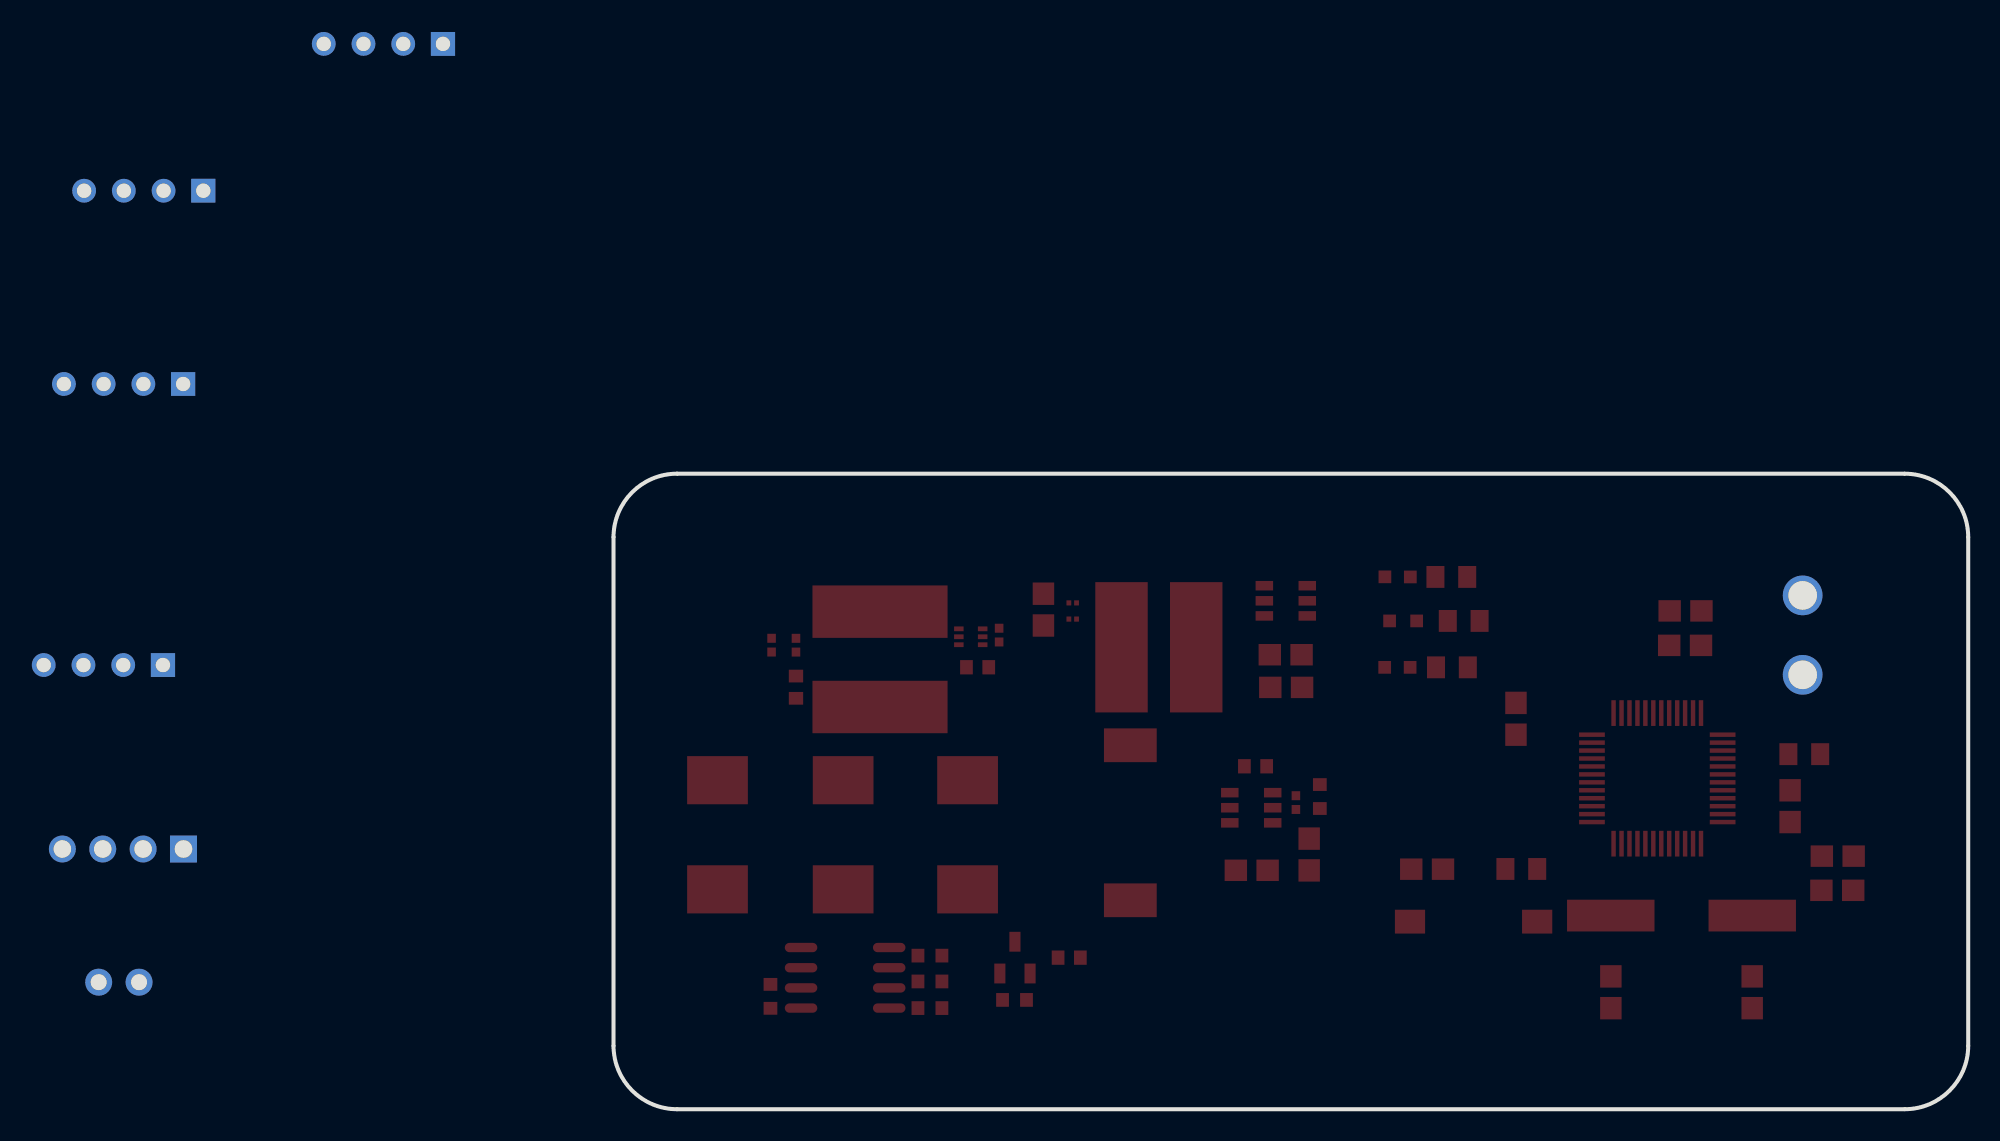
[diagram p3: board, bottom side, seen from below]

Outline 85.22 x 40 mm; copper layers: Top Layer, Bottom Layer. Coordinates in mm from the lower left corner of the outline.
Outline path: 0,36 0,4 arc(1.17,1.17) 4,0 81.22,0 arc(84.05,1.17) 85.22,4 85.22,36 arc(84.05,38.83) 81.22,40 4,40 arc(1.17,38.83) 0,36
Stack: Top Layer 0.035mm / Dielectric1 1.51mm FR4 er 4.5 / Bottom Layer 0.035mm

## Design rules (mm)
template: JLCPCB Capability(Two Layers Board)
spacing copperThickness1oz (default): track to track 0.102, other pairs 0.152 to 0.3
spacing copperThickness2oz: track to track 0.203, other pairs 0.152 to 0.3
track width copperThickness1oz (default): min 0.127, default 0.254, max 2.54
track width copperThickness2oz: min 0.203, default 0.254, max 2.54
differential pair differentialPair (default): width min 0.127, default 0.254, max 2.54; gap min 0.152, default 0.152
via viaSize (default): diameter min 0.5, default 0.61, max 10; hole min 0.3, default 0.305, max 6.3

## Placement (name value [footprint] x y rotation side)
C1  100nF  [C0603]  56.55 9.54 0 top
C2  3.3uF  [C0603]  44.83 21.58 0 top
C3  100nF  [C0805]  45.07 15.04 180 top
C4  33uF  [C0805]  41.46 16.03 90 top
C5  100nF  [C0805]  42.9 26.55 180 top
C6  10uF  [C0805]  42.93 28.61 180 top
C7  22uF  [C0805]  58.17 31.45 90 top
C8  4.7uF  [C0603]  62.31 27.82 180 top
C9  22uF  [C0603]  73.74 26.56 90 top
C17  100nF  [C0805]  34.04 15.11 0 top
C18  22pF  [C0805]  22.48 7.36 90 top
C19  22pF  [C0805]  13.59 7.36 90 top
C20  100nF  [C0805]  28.45 24.57 90 top
C21  100nF  [C0805]  17.81 29.19 0 top
C22  100nF  [C0805]  11.2 19.07 90 top
C23  4.7uF  [C0805]  17.78 31.36 0 top
C34  100nF  [C0805]  8.23 13.78 0 top
C35  4.7uF  [C0805]  8.21 15.93 180 top
CN5  B2B-XH-A(LF)(SN)  [CONN-TH_B2B-XH-A-LF-SN]  116.33 8 0 top
CN6  ZX-XH2.54-4PWZ  [CONN-TH_4P-P2.50_ZX-XH2.54-4PWZ]  99.69 67.05 0 top
CN7  ZX-XH2.54-4PWZ  [CONN-TH_4P-P2.50_ZX-XH2.54-4PWZ]  114.77 57.81 0 top
CN8  ZX-XH2.54-4PWZ  [CONN-TH_4P-P2.50_ZX-XH2.54-4PWZ]  116.04 45.64 0 top
CN9  ZX-XH2.54-4PWZ  [CONN-TH_4P-P2.50_ZX-XH2.54-4PWZ]  117.31 27.96 0 top
CN10  XT30UPB-M  [CONN-TH_XT30UPB-M]  10.41 29.84 90 top
D1  SMCJ6.5CA  [SMC_L6.8-W5.9-LS7.9-BI]  70.77 17.27 90 top
D2  SMCJ6.5CA  [SMC_L6.8-W5.9-LS7.9-BI]  62.94 17.27 270 top
D3  SMCJ6.5CA  [SMC_L6.8-W5.9-LS7.9-BI]  78.68 17.27 90 top
H7  PZ254V-11-04P  [HDR-TH_4P-P2.54-V-M]  116.08 16.38 0 top
L1  15uH  [IND-SMD_L10.2-W10.0]  52.71 18.03 90 top
L2  VLP8040T-3R3N  [IND-SMD_L8.7-W8.6]  50.91 29.07 0 top
L3  1uH  [IND-SMD_L8.2-W7.9]  68.45 28.32 270 top
LED9  XL-1608UBC-04  [LED0603-RD_BLUE]  35.89 33.5 180 top
LED10  SZYY0603O  [LED0603-R-RD_ORANGE]  35.55 30.73 180 top
LED11  TZ-P2-0603YGTCS1-0.6T  [LED0603-RD]  35.91 27.81 180 top
Q1  SS8050  [SOT-23-3_L2.9-W1.3-P1.90-LS2.4-BR]  59.97 9.54 270 top
R1  1kΩ  [R0603]  75.34 7.1 270 top
R2  4.7kΩ  [R0603]  65.31 6.37 0 top
R3  4.7kΩ  [R0603]  59.99 6.88 0 top
R4  4.7kΩ  [R0603]  65.31 9.67 180 top
R5  4.7kΩ  [R0603]  65.31 8.04 0 top
R6  100kΩ  [R0402]  42.29 19.3 270 top
R7  22kΩ  [R0603]  40.79 19.68 90 top
R8  56.2kΩ  [R0201]  56.33 31.87 0 top
R9  10kΩ  [R0201]  56.33 30.85 180 top
R10  475kΩ  [R0402]  60.96 29.84 270 top
R11  453kΩ  [R0402]  73.74 29.2 270 top
R12  100kΩ  [R0402]  75.27 29.21 90 top
R20  10kΩ  [R0805]  28.11 15.12 0 top
R38  50Ω  [R0805]  32.48 27.81 180 top
R39  150Ω  [R0805]  31.74 30.73 180 top
R40  560Ω  [R0805]  32.51 33.5 180 top
R41  10kΩ  [R0805]  10.31 22.35 180 top
SW1  TS-1101-C-W  [SW-SMD_L6.0-W3.3-LS8.0]  31.12 11.81 0 top
U1  STM32U031C8T6  [LQFP-48_L7.0-W7.0-P0.50-LS9.0-BL_1]  19.56 20.82 0 top
U2  MAX485ESA-EV  [SOIC-8_L4.9-W3.9-P1.27-LS6.0-BL]  70.65 8.27 90 top
U3  TPS54308DDCR  [SOT-23-6_L2.9-W1.6-P0.95-LS2.8-BR]  45.1 18.97 0 top
U4  TPS563200DDCR  [SOT-23-6_L2.9-W1.6-P0.95-LS2.8-BR]  42.93 32 0 top
U5  TLV62569APDRLR  [SOT-563_L1.6-W1.2-P0.50-LS1.6-BR]  62.74 29.74 0 top
X1  8MHz  [CRYSTAL-SMD_L11.5-W4.8-LS12.7]  18.03 12.19 0 top

## Footprints (pads in the part's own frame, mm; a bottom-side part is the same pattern mirrored in y, then rotated)
C0603
  rect 0.8x0.9 smd: 1(-0.7,0) 2(0.7,0)
C0805
  rect 1.41x1.35 smd: 1(-1,0) 2(1,0)
CONN-TH_4P-P2.50_ZX-XH2.54-4PWZ
  rect 1.524x1.5 hole 0.9: 1(-3.75,0)
  round 1.5 hole 0.9: 2(-1.25,0) 3(1.25,0) 4(3.75,0)
CONN-TH_B2B-XH-A-LF-SN
  round 1.7 hole 1: 1(1.27,0) 2(-1.27,0)
CONN-TH_XT30UPB-M
  round 2.5 hole 1.8: 1(-2.5,0) 2(2.5,0)
CRYSTAL-SMD_L11.5-W4.8-LS12.7
  rect 5.5x2 smd: 1(-4.45,0) 2(4.45,0)
HDR-TH_4P-P2.54-V-M
  rect 1.7x1.7 hole 1.1: 1(-3.81,0)
  round 1.7 hole 1.1: 2(-1.27,0) 3(1.27,0) 4(3.81,0)
IND-SMD_L8.2-W7.9
  rect 3.3x8.5 smd: 1(-3,0) 2(3,0)
IND-SMD_L8.7-W8.6
  rect 3.3x8.2 smd: 1(-2.35,0) 2(2.35,0)
IND-SMD_L10.2-W10.0
  rect 2.124x3.32 smd: 1(4.878,0) 2(-4.878,0)
LED0603-R-RD_ORANGE
  rect 0.8x0.8 smd: 1(0.851,0) 2(-0.851,0)
LED0603-RD
  rect 0.8x0.8 smd: 1(-0.799,0) 2(0.799,0)
LED0603-RD_BLUE
  rect 0.8x0.8 smd: 1(-0.799,-0.004) 2(0.799,0.004)
LQFP-48_L7.0-W7.0-P0.50-LS9.0-BL_1
  rect 0.28x1.62 smd: 1(-2.75,-4.11) 2(-2.25,-4.11) 3(-1.75,-4.11) 4(-1.25,-4.11) 5(-0.75,-4.11) 6(-0.25,-4.11) 7(0.25,-4.11) 8(0.75,-4.11) 9(1.25,-4.11) 10(1.75,-4.11) 11(2.25,-4.11) 12(2.75,-4.11) 25(2.75,4.11) 26(2.25,4.11) 27(1.75,4.11) 28(1.25,4.11) 29(0.75,4.11) 30(0.25,4.11) 31(-0.25,4.11) 32(-0.75,4.11) 33(-1.25,4.11) 34(-1.75,4.11) 35(-2.25,4.11) 36(-2.75,4.11)
  rect 1.62x0.28 smd: 13(4.11,-2.75) 14(4.11,-2.25) 15(4.11,-1.75) 16(4.11,-1.25) 17(4.11,-0.75) 18(4.11,-0.25) 19(4.11,0.25) 20(4.11,0.75) 21(4.11,1.25) 22(4.11,1.75) 23(4.11,2.25) 24(4.11,2.75) 37(-4.11,2.75) 38(-4.11,2.25) 39(-4.11,1.75) 40(-4.11,1.25) 41(-4.11,0.75) 42(-4.11,0.25) 43(-4.11,-0.25) 44(-4.11,-0.75) 45(-4.11,-1.25) 46(-4.11,-1.75) 47(-4.11,-2.25) 48(-4.11,-2.75)
R0201
  rect 0.303x0.324 smd: 1(-0.241,0) 2(0.241,0)
R0402
  rect 0.566x0.54 smd: 1(-0.433,0) 2(0.433,0)
R0603
  rect 0.806x0.864 smd: 1(-0.753,0) 2(0.753,0)
R0805
  rect 1.133x1.377 smd: 1(-1,0) 2(1,0)
SMC_L6.8-W5.9-LS7.9-BI
  rect 3.03x3.82 smd: 1(3.435,0) 2(-3.435,0)
SOIC-8_L4.9-W3.9-P1.27-LS6.0-BL
  oval 0.588x2.045 smd: 1(-1.905,-2.772) 2(-0.635,-2.772) 3(0.635,-2.772) 4(1.905,-2.772) 5(1.905,2.772) 6(0.635,2.772) 7(-0.635,2.772) 8(-1.905,2.772)
SOT-23-3_L2.9-W1.3-P1.90-LS2.4-BR
  rect 1.25x0.7 smd: 1(1,-0.95) 2(1,0.95) 3(-1,0)
SOT-23-6_L2.9-W1.6-P0.95-LS2.8-BR
  rect 1.1x0.6 smd: 1(1.35,-0.95) 2(1.35,0) 3(1.35,0.95) 4(-1.35,0.95) 5(-1.35,0) 6(-1.35,-0.95)
SOT-563_L1.6-W1.2-P0.50-LS1.6-BR
  rect 0.6x0.3 smd: 1(0.75,-0.5) 2(0.75,0) 3(0.75,0.5) 4(-0.75,0.5) 5(-0.75,0) 6(-0.75,-0.5)
SW-SMD_L6.0-W3.3-LS8.0
  rect 1.9x1.5 smd: 1(-4,0) 2(4,0)

## Nets
As in the schematic.

Pads without a net: U1 2 5 6 8 9 10 11 14 15 16 17 18 19 20 21 22 25 26 27 28 29 32 33 38 39 40 41 42 43 45 46; U3 5
